# Altium project LineFollower.PrjPcb
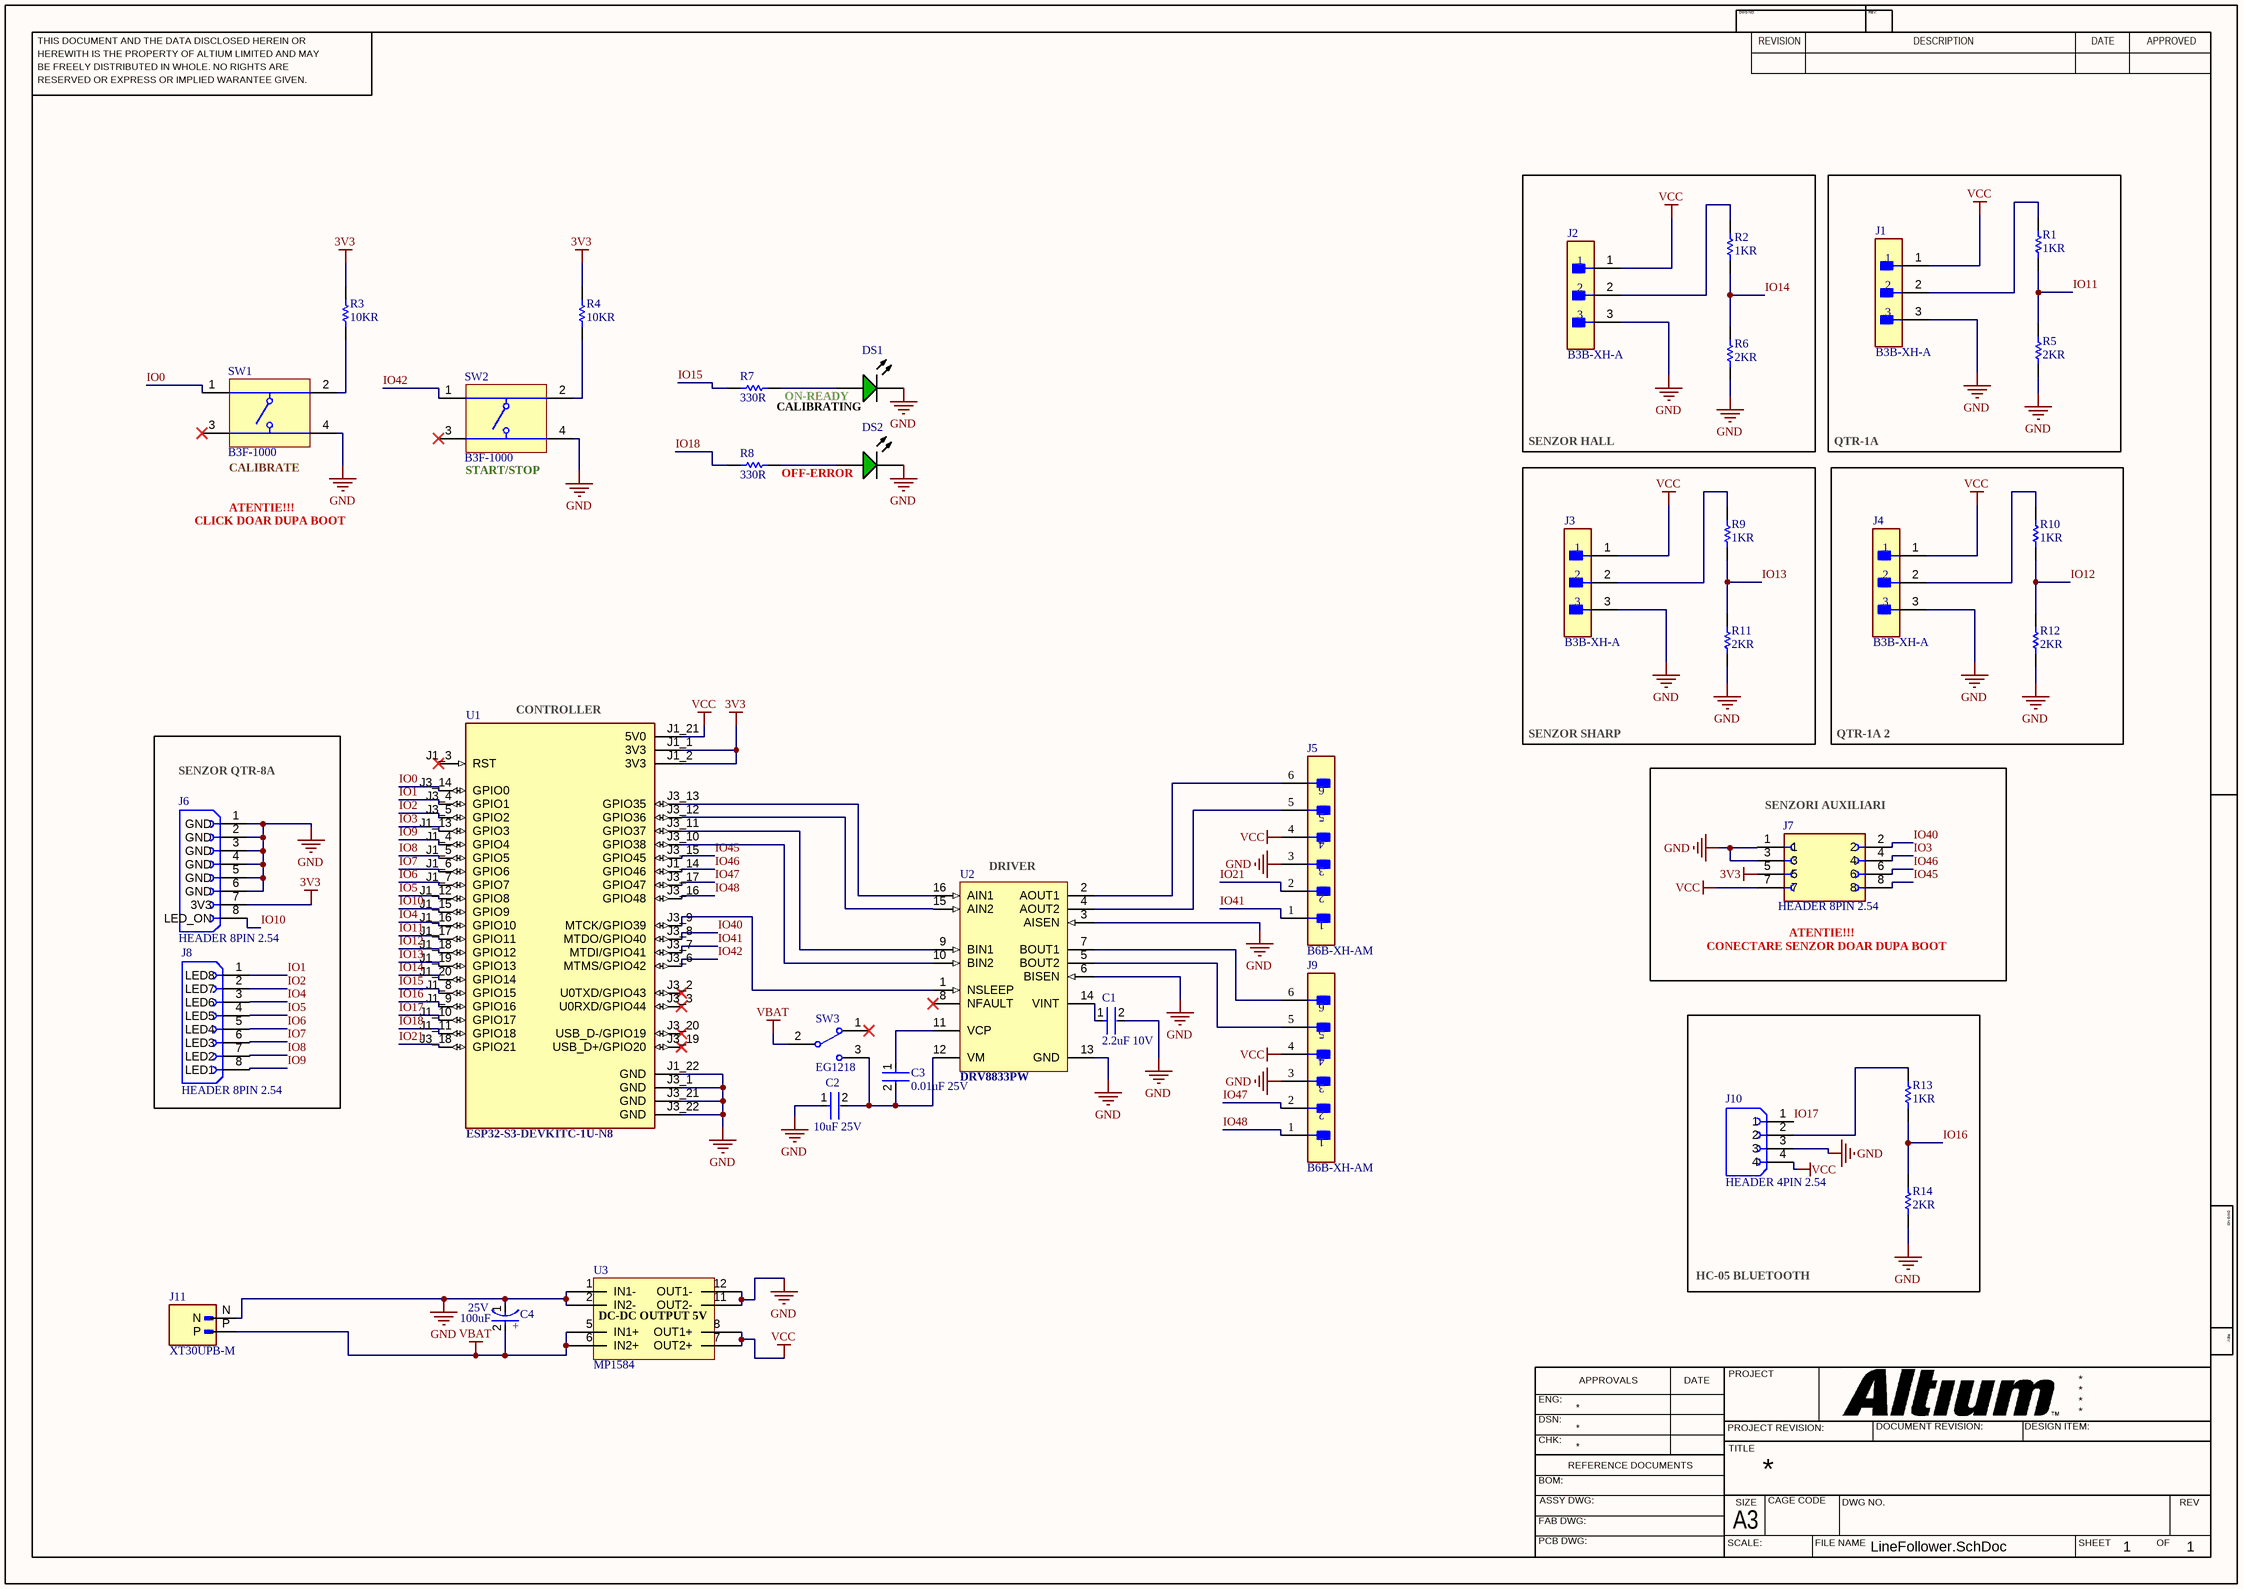
[diagram p0: LineFollower.SchDoc]
1 sheet, 37 parts. Net scope: global (net labels, ports and power ports of the same name join across sheets).
Board file: LineFollower.PcbDoc

## Sheet LineFollower.SchDoc
size 420 x 297 mm; SheetNumber: 1; SheetTotal: 1; SPICEModelCacheHLGINNME: <root> / <DocumentId>HLGINNME</DocumentId> / </root>

### Parts
C1  2.2uF 10V  [FP-CL21-IPC_B]
C2  10uF 25V  [FP-CL21-IPC_B]
C3  0.01uF 25V  [FP-CL21-IPC_B]
C4  Voltage: 25V  Capacitance: 100uF  [FP-RAD-TH-D_8_0_5-L_11_5-MFG]  (hidden comment: EEUTA1E101)
DS1  304090040  [LED-2P-2.28-3MM]  (value not drawn)
DS2  304090040  [LED-2P-2.28-3MM]  (value not drawn)
J1  B3B-XH-A  [FP-B3B-XH-A_LF_SN-MFG]
J2  B3B-XH-A  [FP-B3B-XH-A_LF_SN-MFG]
J3  B3B-XH-A  [FP-B3B-XH-A_LF_SN-MFG]
J4  B3B-XH-A  [FP-B3B-XH-A_LF_SN-MFG]
J5  B6B-XH-AM  [FP-B6B-XH-AM_LF_SN-MFG]
J6  HEADER 8PIN 2.54  [GRAVITECH_8FX1-254MM]
J7  HEADER 8PIN 2.54  [SULLINS_PPPC042LFBN-RC]
J8  HEADER 8PIN 2.54  [GRAVITECH_8FX1-254MM]
J9  B6B-XH-AM  [FP-B6B-XH-AM_LF_SN-MFG]
J10  HEADER 4PIN 2.54  [SULLINS_PPTC041LFBN-RC]
J11  XT30UPB-M  [AMASS_XT30UPB-M]
R1  1KR  [RESC2013X60X30LL20T20]
R2  1KR  [RESC2013X60X30LL20T20]
R3  10KR  [RESC2013X60X30LL20T20]
R4  10KR  [RESC2013X60X30LL20T20]
R5  2KR  [RESC2013X60X30LL20T20]
R6  2KR  [RESC2013X60X30LL20T20]
R7  330R  [RESC2013X60X30LL20T20]
R8  330R  [RESC2013X60X30LL20T20]
R9  1KR  [RESC2013X60X30LL20T20]
R10  1KR  [RESC2013X60X30LL20T20]
R11  2KR  [RESC2013X60X30LL20T20]
R12  2KR  [RESC2013X60X30LL20T20]
R13  1KR  [RESC2013X60X30LL20T20]
R14  2KR  [RESC2013X60X30LL20T20]
SW1  B3F-1000  [OMRON-B3F-1000-4_V]
SW2  B3F-1000  [OMRON-B3F-1000-4_V]
SW3  EG1218  [ESWI-EG1218_V]
U1  ESP32-S3-DEVKITC-1U-N8  [MODULE_ESP32-S3-DEVKITC-1U-N8R8]
U2  DRV8833PW  [PW0016A_M]
U3  MP1584  [MP1584]

### Blocks framed on the sheet
SENZOR HALL: J2 R2 R6
QTR-1A: J1 R1 R5
QTR-1A 2: J4 R10 R12
SENZOR QTR-8A: J6 J8
HC-05 BLUETOOTH: J10 R13 R14

### Nets
3V3: J6.7(3V3) J7.5 R3.2 R4.2 U1.J1_1(3V3) U1.J1_2(3V3)
GND: C1.2 C2.1 C4.1(C) DS1.2(K) DS2.2(K) J1.3 J2.3 J3.3 J4.3 J5.3 J6.1(GND) J6.2(GND) J6.3(GND) J6.4(GND) J6.5(GND) J6.6(GND) J7.1 J7.3 J9.3 J10.3 J11.N R5.1 R6.1 R11.1 R12.1 R14.1 SW1.4 SW2.4 U1.J1_22(GND) U1.J3_1(GND) U1.J3_21(GND) U1.J3_22(GND) U2.3(AISEN) U2.6(BISEN) U2.13(GND) U3.1(IN1-) U3.2(IN2-) U3.11(OUT2-) U3.12(OUT1-)
VBAT: C4.2(A) J11.P SW3.2(COM) U3.5(IN1+) U3.6(IN2+)
VCC: J1.1 J2.1 J3.1 J4.1 J5.4 J7.7 J9.4 J10.4 U1.J1_21(5V0) U3.7(OUT2+) U3.8(OUT1+)
IO0: SW1.1 U1.J3_14(GPIO0)
IO1: J8.1(LED8) U1.J3_4(GPIO1)
IO2: J8.2(LED7) U1.J3_5(GPIO2)
IO3: J7.4 U1.J1_13(GPIO3)
IO4: J8.3(LED6) U1.J1_16(GPIO10)
IO5: J8.4(LED5) U1.J1_12(GPIO8)
IO6: J8.5(LED4) U1.J1_7(GPIO7)
IO7: J8.6(LED3) U1.J1_6(GPIO6)
IO8: J8.7(LED2) U1.J1_5(GPIO5)
IO9: J8.8(LED1) U1.J1_4(GPIO4)
IO10: J6.8(LED_ON) U1.J1_15(GPIO9)
IO11: R1.1 R5.2 U1.J1_17(GPIO11)
IO12: R10.1 R12.2 U1.J1_18(GPIO12)
IO13: R9.1 R11.2 U1.J1_19(GPIO13)
IO14: R2.1 R6.2 U1.J1_20(GPIO14)
IO15: R7.2 U1.J1_8(GPIO15)
IO16: R13.1 R14.2 U1.J1_9(GPIO16)
IO17: J10.1 U1.J1_10(GPIO17)
IO18: R8.2 U1.J1_11(GPIO18)
IO21: J5.2 U1.J3_18(GPIO21)
IO40: J7.2 U1.J3_8(MTDO/GPIO40)
IO41: J5.1 U1.J3_7(MTDI/GPIO41)
IO42: SW2.1 U1.J3_6(MTMS/GPIO42)
IO45: J7.8 U1.J3_15(GPIO45)
IO46: J7.6 U1.J1_14(GPIO46)
IO47: J9.2 U1.J3_17(GPIO47)
IO48: J9.1 U1.J3_16(GPIO48)
NetC1_1: C1.1 U2.14(VINT)
NetC2_2: C2.2 C3.2 SW3.3 U2.12(VM)
NetC3_1: C3.1 U2.11(VCP)
NetDS1_1: DS1.1(A) R7.1
NetDS2_1: DS2.1(A) R8.1
NetJ1_2: J1.2 R1.2
NetJ2_2: J2.2 R2.2
NetJ3_2: J3.2 R9.2
NetJ4_2: J4.2 R10.2
NetJ5_5: J5.5 U2.4(AOUT2)
NetJ5_6: J5.6 U2.2(AOUT1)
NetJ9_5: J9.5 U2.5(BOUT2)
NetJ9_6: J9.6 U2.7(BOUT1)
NetJ10_2: J10.2 R13.2
NetR3_1: R3.1 SW1.2
NetR4_1: R4.1 SW2.2
NetU1_J3_9: U1.J3_9(MTCK/GPIO39) U2.1(NSLEEP)
NetU1_J3_10: U1.J3_10(GPIO38) U2.10(BIN2)
NetU1_J3_11: U1.J3_11(GPIO37) U2.9(BIN1)
NetU1_J3_12: U1.J3_12(GPIO36) U2.15(AIN2)
NetU1_J3_13: U1.J3_13(GPIO35) U2.16(AIN1)

Not connected (* = marked no-connect by the designer): SW1 3*; SW2 3*; SW3 1*; U1 J1_3(RST)* J3_2(U0TXD/GPIO43)* J3_3(U0RXD/GPIO44)* J3_19(USB_D+/GPIO20)* J3_20(USB_D-/GPIO19)*; U2 8(NFAULT)*

### Notes on the sheet
- CALIBRATING
- (near R7) ON-READY
- CLICK DOAR DUPA BOOT
- (near SW1) CALIBRATE
- ATENTIE!!!
- (near SW2) START/STOP
- (near R8) OFF-ERROR
- (near U1) CONTROLLER
- SENZOR SHARP
- (near U2) DRIVER
- (near J7) SENZORI AUXILIARI
- (near J7) ATENTIE!!!
- (near J7) CONECTARE SENZOR DOAR DUPA BOOT
- (near U3) DC-DC OUTPUT 5V
- THIS DOCUMENT AND THE DATA DISCLOSED HEREIN OR
- HEREWITH IS THE PROPERTY OF ALTIUM LIMITED AND MAY
- DWG NO:
- REVISION
- REV:
- DESCRIPTION
- DATE
- APPROVED
- BE FREELY DISTRIBUTED IN WHOLE. NO RIGHTS ARE
- RESERVED OR EXPRESS OR IMPLIED WARANTEE GIVEN.
- ENG:
- APPROVALS
- PROJECT
- DSN:
- CHK:
- REFERENCE DOCUMENTS
- PROJECT REVISION:
- TITLE
- DOCUMENT REVISION:
- DESIGN ITEM:
- BOM:
- FAB DWG:
- PCB DWG:
- ASSY DWG:
- SCALE:
- A3
- SIZE
- CAGE CODE
- FILE NAME
- DWG NO.
- SHEET
- OF
- REV
- (in symbol CMP-05427-002094-1) +

### Library data of the parts
C1-C3 = CMP-13271-004554-1: CL21 Series 0805 10uF 25V ±20% Tolerance X5R Multilayer Ceramic Chip Capacitor; RoHS Compliant: Yes
C4 = CMP-05427-002094-1: Aluminum Electrolytic Capacitors (Radial Lead Type) AEC-Q200 Qualified 100uF ±20% 25V; Dielectric Material: Aluminium; Lead Length: 17mm; ESR (Equivalent Series Resistance): 130mR; Ripple Current: 500mA; Polarity: Polar; Life (Hours): 2000Hour; Lead Diameter: 0.6mm; Leakage Current: 25uA; Length: 11.5mm; Mount: Through Hole; Number of Pins: 2; Packaging: Bulk; Tolerance: 20%; RoHS Compliant: Yes; Lead Pitch: 3.5mm; Radiation Hardening: No; Height - Seated (Max): 0.492inch; Height: 11.5mm; Max Operating Temperature: 125°C; Voltage Rating: 25V; Package Quantity: 200; Contact Plating: Tin; Series: TA; Impedance: 130mR; Termination: Radial; Case/Package: Radial; Diameter: 8mm; Voltage Rating (DC): 25V; Min Operating Temperature: -40°C; Construction: RADIAL
DS1 DS2 = CMP-007-00006-2: Green LED, 80 mW, 20 mA, -25 to 85 degC, 2-Pin THD; Manufacturer: Shenzhen CGX; Manufacturer URL: http://szcgx.com/; Package Reference: 304090040; Datasheet Version: Rev. 1.0, 09/2014; RoHS Compliant: Unknown; Case/Package: 304090040; Package Description: 2-Pin Through Hole Device, Dia 3 mm, Pitch 2.28 mm; Datasheet URL: http://datasheet.octopart.com/304090040-Chengguangxing-datasheet-62330655.pdf; Mounting Technology: TH
J1-J4 = CMP-17439-000014-3: CONN HEADER VERT 3POS 2.5MM; Max Voltage Rating (DC): 250V; Number of Positions: 3; Current Rating: 3A; Gender: Male; Wire/Cable Gauge: 22AWG; Contact Resistance: 20mR; Insulation Resistance: 1GR; Insulation Material: Nylon; Contact Plating: Tin; Depth: 5.75mm; Contact Type: Male Pin; Max Operating Temperature: 85°C; Insulation Color: Natural; Voltage Rating (AC): 250V; Color: Natural; Connector Type: Header; Orientation: Straight; Fastening Type: Detent; Housing Color: White; Min Operating Temperature: -25°C; Termination: Solder; Voltage Rating: 250V; Series: XH; Pitch: 2.5mm; Contact Shape: Square; Number of Rows: 1; Lead Free: Lead Free; Packaging: Bulk; Mount: Through Hole; Flammability Rating: UL94 V-0; Max Voltage Rating (AC): 250V; REACH SVHC: No SVHC; Housing Material: Polyamide; Contact Material: Brass; Lead Pitch: 2.5mm; Contact Finish - Mating: TIN; Length: 9.9mm; Max Current Rating: 3A; Number of Contacts: 3
J5 J9 = CMP-17439-000167-1: CONN HEADER VERT 6POS 2.5MM; Shape: Straight; Current Rating: 3A; Mated Stacking Heights: 9.8mm; Number of Positions: 6; Voltage Rating: 250V; Pitch: 2.5mm; Insulation Color: Natural; Number of Pins: 6; Width: 5.75mm; Flammability Rating: UL94 V-0; Packaging: Bulk; Connector Type: Header; Number of Rows: 1; Contact Plating: Copper; Mount: Through Hole; Min Operating Temperature: -25°C; Contact Type: Male Pin; Contact Shape: Square; Fastening Type: Detent; Length: 17.4mm; Series: XH; Contact Finish - Mating: TIN; Max Operating Temperature: 85°C; Insulation Material: Nylon; Number of Poles: 6; Termination: Press-Fit; Contact Material: Brass; Height: 7mm
J6 J8 = 8FX1-254MM: Headers & Wire Housings 2.54MM 0.1 8-PIN FEMALE HEADER; MF: Gravitech; MP: 8Fx1-254mm; SnapEDA_Link: https://www.snapeda.com/parts/8Fx1-254mm/Gravitech/view-part/?ref=snap; Price: None; Purchase-URL: https://pricing.snapeda.com/search/part/8Fx1-254mm/?ref=eda; Package: None; Availability: In Stock; Check_prices: https://www.snapeda.com/parts/8Fx1-254mm/Gravitech/view-part/?ref=eda; Value: *
J7 = PPPC042LFBN-RC: 8 Position Total Dual Row 2.54 mm Pitch Straight Female Header; MF: Sullins Connector Solutions; MP: PPPC042LFBNRC; SnapEDA_Link: https://www.snapeda.com/parts/PPPC042LFBNRC/Sullins/view-part/?ref=snap; Package: None; Value: *; Check_prices: https://www.snapeda.com/parts/PPPC042LFBNRC/Sullins/view-part/?ref=eda
J10 = PPTC041LFBN-RC: 4 Position Header Connector 0.100 (2.54mm) Through Hole Tin; MF: Sullins Connector; SnapEDA_Link: https://www.snapeda.com/parts/PPTC041LFBN-RC/Sullins/view-part/?ref=snap; Package: None; Value: *; MP: PPTC041LFBN-RC; Check_prices: https://www.snapeda.com/parts/PPTC041LFBN-RC/Sullins/view-part/?ref=eda
J11 = XT30UPB-M: Socket; DC supply; XT30; male; PIN: 2; on PCBs; THT; yellow; 15A; 500V; MF: amass; SnapEDA_Link: https://www.snapeda.com/parts/XT30UPB-M/AMASS/view-part/?ref=snap; Package: None; Value: *; MP: XT30UPB-M; Check_prices: https://www.snapeda.com/parts/XT30UPB-M/AMASS/view-part/?ref=eda
R1-R14 = CMP-2001-02616-1: Manufacturer: KOA Speer; Part Number: SG73S2ATTD1002F
SW1 SW2 = CMP-011-00004-2: Tactile Switch, SPST-NO, 0.05 A, 24 V, -25 to 70 degC, 4-Pin THD, RoHS, Bulk; Manufacturer: Omron Electronic Components; Throw Configuration: SPST; Max Contact Resistance: 100mohm; Resistance: 0.1Ohm; Max Current Rating: 50mA; Voltage Rating: 24V; Operating Force: 100gf; Datasheet Version: Jan-15; Case/Package: B3F-1000; Packaging: Bulk; Package Description: 4-Pin Through Hole Device, Body 6 x 6 mm; Manufacturer URL: http://www.omron.com/; Package Reference: B3F-1000; Contact Plating: Gold; Contact Current Rating: 50mA; RoHS Compliant: True; Contact Material: Gold; Mounting Technology: TH; Max Operating Temperature: 70°C; Min Operating Temperature: -25°C; Package Quantity: 1500; Datasheet URL: http://www.omron.com/ecb/products/pdf/en-b3f.pdf; Voltage Rating (DC): 24V; Pins: 4; Current Rating: 50mA; Max Voltage Rating (DC): 24V
SW3 = CMP-1696-00002-1: Slide Switch, 500 V, -20 to 70 degC, 3-Pin THD, RoHS; Case\Package: SOT-23-5; Output Current: 150 mA; Nominal Output Voltage: 3.3 V; Max Power Dissipation: 250 mW; Min Input Voltage: 4.3 V; Outputs: 1; Max Input Voltage: 8 V; Dropout Voltage: 300 mV; PackageDescription: 3-Pin Through Hole Device, Body 11.6 x 4 mm, Pitch 2.5 mm; ComponentLink1URL: http://www.e-switch.ch/en/; RoHSCompliant: true; Length: 3 mm; ComponentLink1Description: Manufacturer URL; Power Rating: 250 mW; Mount: Surface Mount; Max Operating Temperature: 85 degC; REACH SVHC: No SVHC; Radiation Hardening: No; Height: 1.3 mm; Pins: 5; Max Ouput Current: 150 mA; Output Voltage: 3.3 V; Width: 1.8 mm; Package Quantity: 3000; ComponentLink2URL: https://www.e-switch.com/system/asset/product_line/data_sheet/119/EG.pdf; Min Operating Temperature: -40 degC; ComponentLink2Description: Datasheet; DatasheetVersion: Oct-15; PackageReference: EG1218; Packaging: Tape and Reel
U1 = ESP32-S3-DEVKITC-1U-N8R8: The ESP32-S3-DEVKITC-1U-N8R8 from Espressif Systems is an evaluation board designed for wireless communication applications. It features a 32-bit Xtensa dual-core processor running at 240MHz, providing strong processing power for complex tasks. The board; SnapEDA_Link: https://www.snapeda.com/parts/ESP32-S3-DEVKITC-1U-N8R8/Espressif+Systems/view-part/?ref=snap; Package: None; Value: *; MF: Espressif Systems; MP: ESP32-S3-DEVKITC-1U-N8R8; Check_prices: https://www.snapeda.com/parts/ESP32-S3-DEVKITC-1U-N8R8/Espressif+Systems/view-part/?ref=eda
U2 = CMP-1529-00002-2: 2 A Low Voltage Dual Brushed DC or Single Bipolar Stepper Motor Driver (PWM Ctrl), 2.7 to 10.8 V, -40 to 85 degC, 16-Pin SOP (PW), Green (RoHS & no Sb/Br), Tube; Manufacturer: Texas Instruments; Peak Output Current: 2 A; RMS Output Current: 1.5 A; Vs: 2.7 V Min.; rDS (ON) (LS + HS): 360 mOhms; PackageVersion: 4040064-4/G; Temperature Range: -40 to 85 degC; ComponentLink2Description: Datasheet; Mounting Technology: Surface Mount; DatasheetVersion: SLVSAR1D; Control I/F: PWM; Eco-Plan: Green (RoHS & no Sb/Br); ComponentLink3URL: http://www.ti.com/lit/ml/mpds361/mpds361.pdf; ComponentLink1Description: Manufacturer URL; PartNumber: DRV8833PW; Package Reference: PW0016A; Packing: Tube; PackageDescription: 16-Pin Plastic Small Outline, Body 4.4 x 5 mm, Pitch 0.65 mm; ComponentLink3Description: Package Specification; ComponentLink1URL: www.ti.com; ComponentLink2URL: http://www.ti.com/lit/ds/symlink/drv8833.pdf